# EAGLE design eletronica (EAGLE 9.6.2)
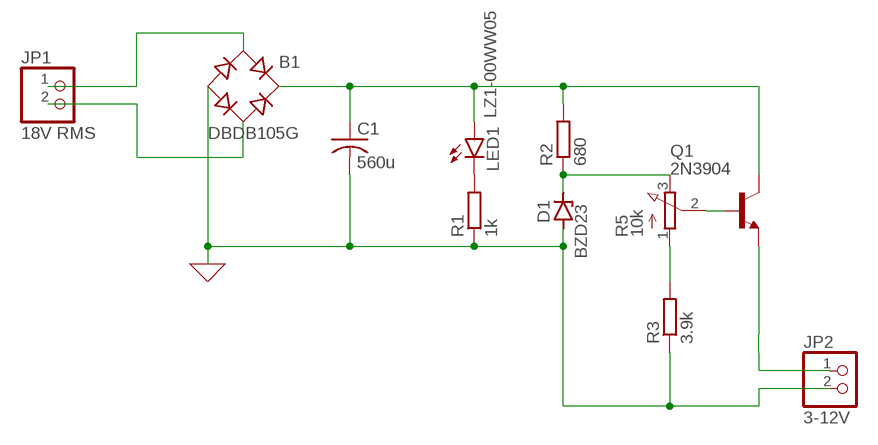
[diagram p0: schematic, sheet 1]

## Parts
B1  DBDB105G  [DB]
C1  560u  C-US025-025X050  [C025-025X050]
D1  BZD23  [SOD81]
JP1  18V RMS  PINHD-1X2  [1X02]
JP2  3-12V  PINHD-1X2  [1X02]
LED1  LZ1-00WW05  [LZ1-00WW03]
Q1  2N3904  [TO92]
R1  1k  R-EU_0204/7  [0204/7]
R2  680  R-EU_0204/7  [0204/7]
R3  3.9k  R-EU_0204/7  [0204/7]
R5  10k  3RP/1610N  [3RP/1610N]

## Nets
N$1: B1.AC1 JP1.1
N$2: B1.AC2 JP1.2
N$3: B1.- C1.2 D1.A JP2.2 R1.1 R3.1 ; supply symbol labelled GND
N$4: B1.+ C1.1 LED1.2(A) LED1.3(A) LED1.5(A) Q1.1(C) R2.2
N$5: D1.C R2.1 R5.3(E)
N$6: Q1.2(B) R5.2(S)
N$7: Q1.3(E)
N$8: R3.2 R5.1(A)
N$9: JP2.1
N$10: LED1.1(C) LED1.4(C) R1.2

## Library data of the parts
B1 = rectifier:DB?*G: Single Phase 1.0 AMP Glass Passivated Bridge Rectifier Taiwan Semiconductor Co.,Ltd. - TSC Source: http://www.taiwansemi.com/TSCbig5/ezcatfiles/cust/img/img/db101g.pdf http://www.ts.com.tw/db/pictures/modules/PDT/PDT060207001/DBLS201G.pdf
C1 = rcl:C-US: CAPACITOR, American symbol; SPICEPREFIX: C
D1 = diode:BZD23: Z DIODE
JP1 JP2 = pinhead:PINHD-1X2: PIN HEADER
LED1 = led:LZ1-00WW05: High Luminous Efficacy 5W Warm White LED Source: http://www.ledengin.com/products/5wLZ/LZ1-00WW05.pdf
Q1 = transistor-npn:2N3904: NPN Transistor
R1-R3 = rcl:R-EU_: RESISTOR, European symbol; SPICEPREFIX: R
R5 = pot:3RP/1610N: 16mm Potentiometer one level Source: http://www.alphapotentiometers.net/html/16mm_pot_2.html

## Board
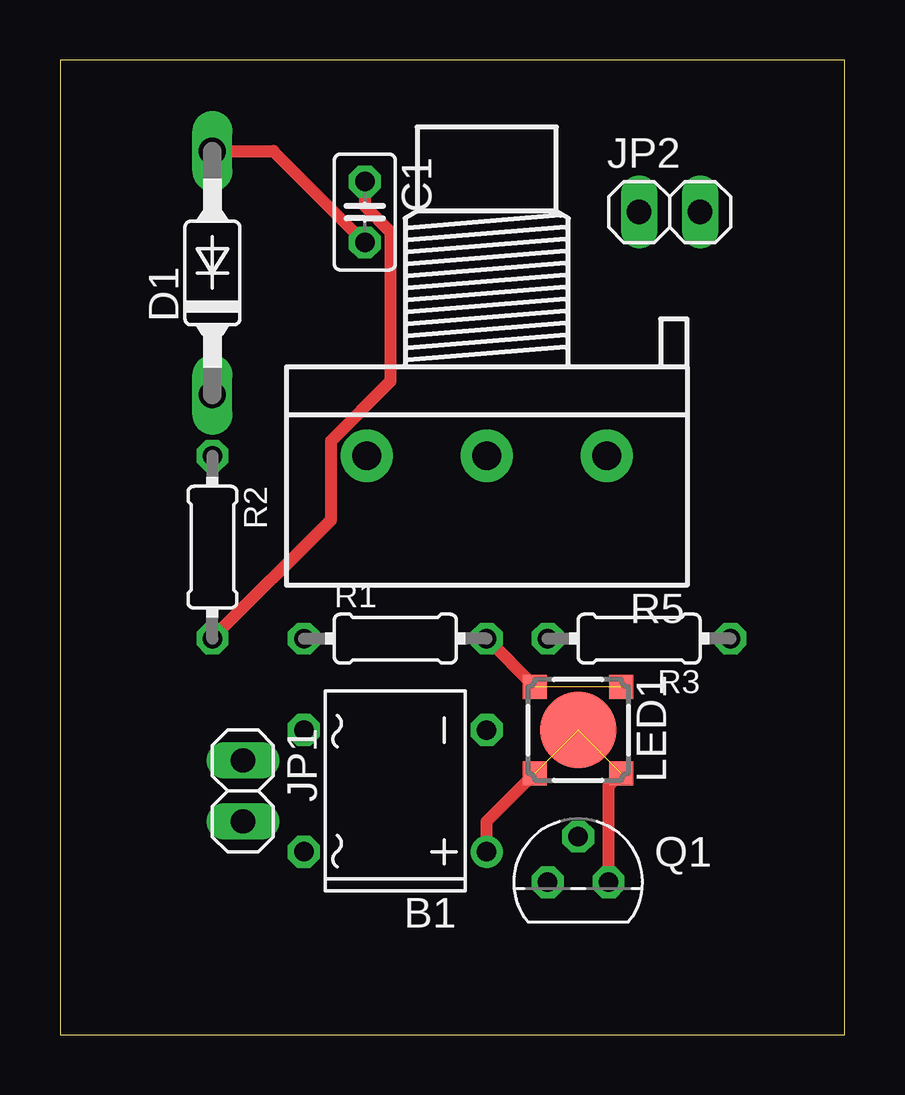
[diagram p1: board, top side]
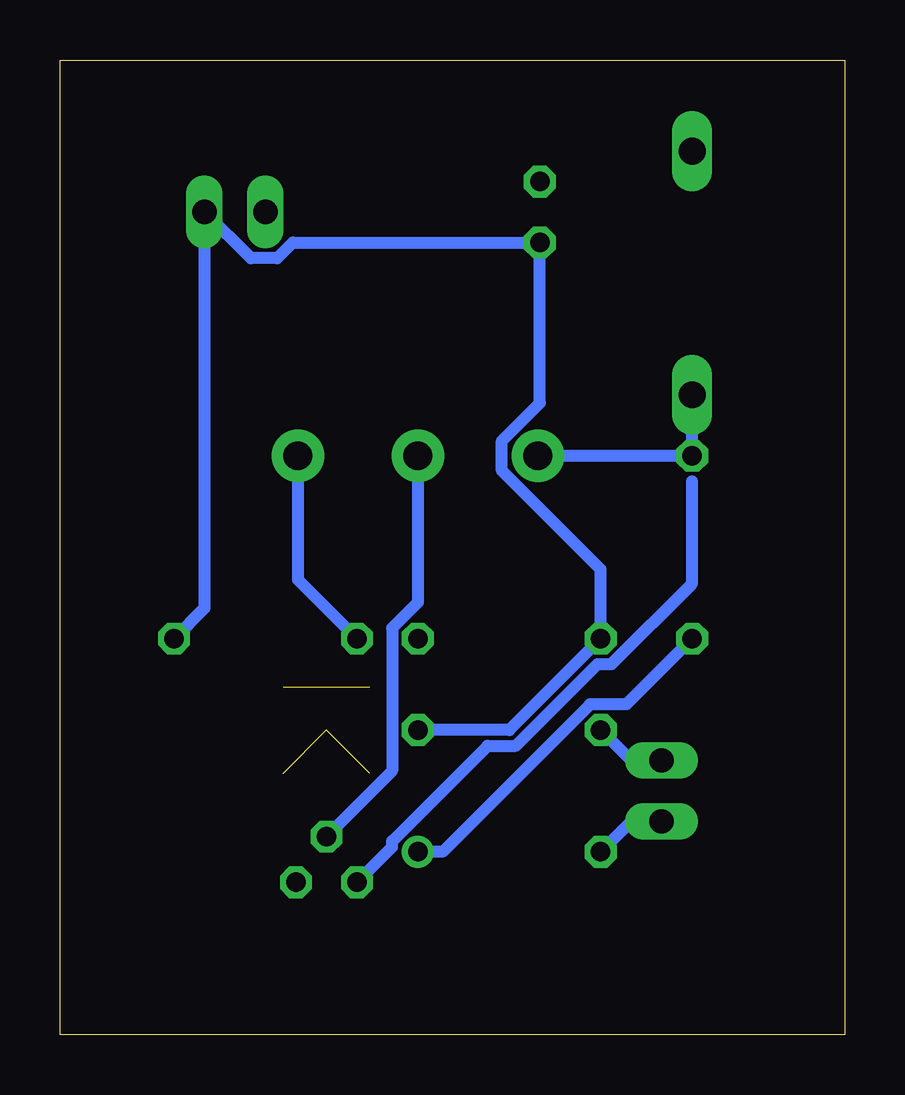
[diagram p2: board, bottom side, seen from below]

Size 32.69 x 40.63 mm. Coordinates in mm from the lower left corner, seen from the top.
Outline: 0,0 32.69,0 32.69,40.63 0,40.63 0,0
Copper layers (1*16): Top 0.035mm / dielectric 1.5mm / Bottom 0.035mm
Design rules "default": minimum track width 6mil, minimum drill 0.35mm, track to track 6mil, track to pad 6mil, pad to pad 6mil, via to via 6mil, smd to smd 6mil, copper to edge 40mil, drill to drill 6mil, minimum pad ring 10mil, minimum via ring 8mil, stop-mask expansion 4mil, vias tented up to drill 0mil, thermal gap 10mil

### Footprints (pad centres in the part's own frame; a part is rotated, then mirrored left to right if it is on the bottom)
DB = drill 0.813: + -2.54,-3.81 | drill 0.813 octagon: - 2.54,-3.81; AC1 2.54,3.81; AC2 -2.54,3.81
C025-025X050 = drill 0.813 octagon: 1 -1.27,0; 2 1.27,0
SOD81 = drill 1.118 long: A 5.08,0; C -5.08,0
1X02 = drill 1.016 long: 1 -1.27,0; 2 1.27,0
LZ1-00WW03 = smd 1 x 1: 1 -1.8,1.8; 2 1.8,1.8; 3 1.8,-1.8; 4 -1.8,-1.8 | smd 3.2 x 3.2: 5 0,0
TO92 = drill 0.813 octagon: 1 1.27,0; 2 0,1.905; 3 -1.27,0
0204/7 = drill 0.813 octagon: 1 -3.81,0; 2 3.81,0
3RP/1610N = drill 1.2 pad 2.184: 1 -5,0; 2 0,0; 3 5,0

### Placement (x,y rotation side)
B1  13.97,10.16 90 top
C1  12.7,34.29 270 top
D1  6.35,31.75 90 top
JP1  7.62,10.16 270 top
JP2  25.4,34.29 0 top
LED1  21.59,12.7 270 top
Q1  21.59,6.35 0 top
R1  13.97,16.51 0 top
R2  6.35,20.32 270 top
R3  24.13,16.51 180 top
R5  17.78,24.13 180 top

### Tracks (layer width: path | path; a pad name or v marks a point on that pad's centre or on a via)
N$1
  Bottom 0.508: JP1.1 8.89,11.43 B1.AC1
N$2
  Bottom 0.508: JP1.2 8.89,8.89 B1.AC2
N$3
  Top 0.508: D1.A 8.89,36.83 C1.2
  Bottom 0.508: R3.1 26.67,17.78 JP2.2 24.74,32.36 23.65,32.36 22.99,33.02 C1.2 12.7,26.33 14.28,24.75 14.28,23.51 10.16,19.39 R1.1 13.97,12.7 B1.-
N$4  (2 unrouted)
  Top 0.508: C1.1 12.7,34.53 13.77,33.46 13.77,27.24 11.28,24.75 11.28,21.44 R2.2 | Q1.1 22.86,10.37 LED1.2 | B1.+ 17.78,8.89 LED1.3
  Bottom 0.508: R2.2 9.09,13.77 10.6,13.77 16.75,7.62 B1.+
N$5
  Bottom 0.508: R5.3 R2.1 D1.C
N$6
  Bottom 0.508: R5.2 17.78,18.02 18.85,16.95 18.85,11 Q1.2
N$7
  Bottom 0.508: Q1.3 18.85,7.82 18.85,8.06 14.87,12.04 13.7,12.04 10.29,15.44 9.72,15.44 6.35,18.81 6.35,23.06
N$8
  Bottom 0.508: R5.1 22.78,18.97 R3.2
N$10  (1 unrouted)
  Top 0.508: R1.2 LED1.4